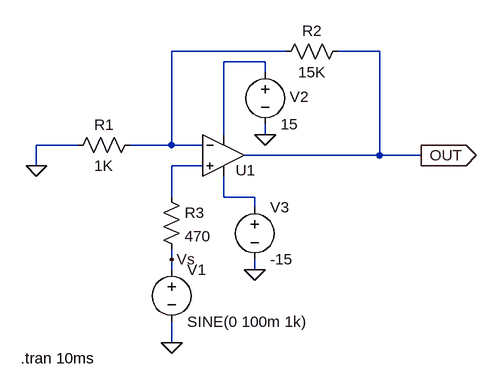
[diagram p0: schematic Run_2_A.asc]
Run_2_A.asc, the LTspice schematic file:
Version 4
SHEET 1 880 680
WIRE 96 -128 -80 -128
WIRE 240 -128 176 -128
WIRE 64 -112 0 -112
WIRE 64 -96 64 -112
WIRE 0 0 0 -112
WIRE 64 0 64 -16
WIRE -224 16 -288 16
WIRE -80 16 -80 -128
WIRE -80 16 -144 16
WIRE -32 16 -80 16
WIRE 240 32 240 -128
WIRE 240 32 32 32
WIRE 304 32 240 32
WIRE -288 48 -288 16
WIRE -32 48 -80 48
WIRE -80 96 -80 48
WIRE 0 96 0 64
WIRE 48 96 0 96
WIRE 48 112 48 96
WIRE -80 192 -80 176
WIRE -80 208 -80 192
WIRE 48 208 48 192
WIRE -80 320 -80 288
FLAG 304 32 OUT
IOPIN 304 32 Out
FLAG -80 320 0
FLAG -288 48 0
FLAG -80 192 Vs
FLAG 64 0 0
FLAG 48 208 0
SYMBOL res -128 0 R90
WINDOW 0 0 56 VBottom 2
WINDOW 3 32 56 VTop 2
SYMATTR InstName R1
SYMATTR Value 1K
SYMBOL OpAmps\\UniversalOpamp2 0 32 R0
WINDOW 0 19 23 Left 2
SYMATTR InstName U1
SYMBOL res 192 -144 R90
WINDOW 0 0 56 VBottom 2
WINDOW 3 32 56 VTop 2
SYMATTR InstName R2
SYMATTR Value 15K
SYMBOL res -96 80 R0
SYMATTR InstName R3
SYMATTR Value 470
SYMBOL voltage -80 192 R0
WINDOW 123 0 0 Left 0
WINDOW 39 0 0 Left 0
SYMATTR InstName V1
SYMATTR Value SINE(0 100m 1k)
SYMBOL voltage 64 -112 R0
WINDOW 0 38 54 Left 2
WINDOW 123 0 0 Left 0
WINDOW 39 0 0 Left 0
SYMATTR InstName V2
SYMATTR Value 15
SYMBOL voltage 48 96 R0
WINDOW 123 0 0 Left 0
WINDOW 39 0 0 Left 0
SYMATTR InstName V3
SYMATTR Value -15
TEXT -312 344 Left 2 !.tran 10ms

The netlist it stands for:
* Run_2_A.asc
R1 N001 0 1K
XU1 N003 N001 N002 N004 OUT level.2 Avol=1Meg GBW=10Meg Slew=10Meg ilimit=25m rail=0 Vos=0 phimargin=45 en=0 enk=0 in=0 ink=0 Rin=500Meg  ; pins IN+ IN- V+ V- OUT
R2 OUT N001 15K
R3 N003 Vs 470
V1 Vs 0 SINE(0 100m 1k)
V2 N002 0 15
V3 N004 0 -15
.tran 10ms
.lib UniversalOpamps2.sub
.backanno
.end